# Altium project Carrier_Board.PrjPcb
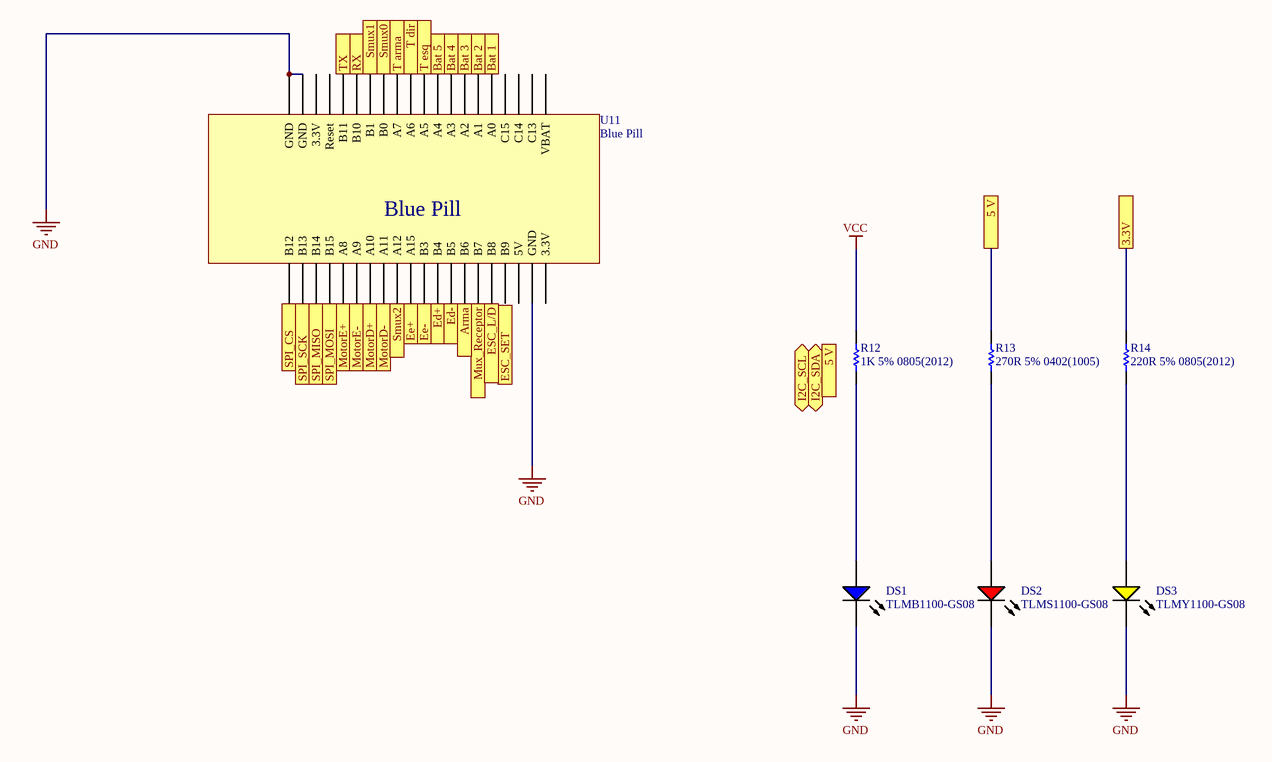
[diagram p0: Carrier_Board.SchDoc]
5 sheets, 41 parts. Net scope: flat (ports and power ports of the same name join across sheets).
Board file: Carrier_Board.PcbDoc
Sheets:
  Carrier_Board.SchDoc
  Recepitor.SchDoc
  ESP8266.SchDoc
  INA219AID.SchDoc
  Morpheus_conector.SchDoc

## Sheet Carrier_Board.SchDoc
size A4

### Parts
(Parts that share a designator on the sheet are numbered #1, #2 ... from top to bottom, then left to right.)
DS1  TLMB1100-GS08  [VISH-TLMX1100-2_V]
DS2  TLMS1100-GS08  [VISH-TLMX1100_V]
DS3  TLMY1100-GS08  [VISH-TLMX1100-2_V]
R12#1  1K 5% 0805(2012)  [RESC0805(2012)_N]
R13#1  270R 5% 0402(1005)  [RESC0402(1005)_N]
R14#1  220R 5% 0805(2012)  [RESC0805(2012)_N]
U11  Blue Pill  [blue pill]

### Ports
3.3V, 5 V, Arma (out), Bat 1 (in), Bat 2 (in), Bat 3 (in), Bat 4 (in), Bat 5 (in), Ed+ (in), Ed- (in), Ee+ (in), Ee- (in), ESC_L/D (out), ESC_SET (out), I2C_SCL (bidir), I2C_SDA (bidir), MotorD+ (out), MotorD- (out), MotorE+ (out), MotorE- (out), Mux_Receptor (in), RX, Smux0 (out), Smux1 (out), Smux2 (out), SPI_CS, SPI_MISO, SPI_MOSI, SPI_SCK, T arma (in), T dir (in), T esq (in), TX

### Nets
GND: DS1.2(K) DS2.2(K) DS3.2(K) U11.?19(GND) U11.?20(GND) U11.?39(GND)
VCC: R12#1.2
NetC11_1: R14#1.2 ; port 3.3V
NetC18_2: R13#1.2 ; port 5 V
NetDS1_1: DS1.1(A) R12#1.1
NetDS2_1: DS2.1(A) R13#1.1
NetDS3_1: DS3.1(A) R14#1.1
NetJ1_6: U11.?25(A8) ; port MotorE+
NetJ1_7: U11.?26(A9) ; port MotorE-
NetJ2_6: U11.?27(A10) ; port MotorD+
NetJ2_7: U11.?28(A11) ; port MotorD-
NetU9_RX: U11.?16(B10) ; port RX
NetU9_TX: U11.?17(B11) ; port TX
NetU10_5: U11.?35(B7) ; port Mux_Receptor
NetU10_9: U11.?14(B0) ; port Smux0
NetU10_10: U11.?15(B1) ; port Smux1
NetU10_11: U11.?29(A12) ; port Smux2
NetU11_?6: U11.?6(A0) ; port Bat 1
NetU11_?7: U11.?7(A1) ; port Bat 2
NetU11_?8: U11.?8(A2) ; port Bat 3
NetU11_?9: U11.?9(A3) ; port Bat 4
NetU11_?10: U11.?10(A4) ; port Bat 5
NetU11_?11: U11.?11(A5) ; port T esq
NetU11_?12: U11.?12(A6) ; port T dir
NetU11_?13: U11.?13(A7) ; port T arma
NetU11_?21: U11.?21(B12) ; port SPI_CS
NetU11_?22: U11.?22(B13) ; port SPI_SCK
NetU11_?23: U11.?23(B14) ; port SPI_MISO
NetU11_?24: U11.?24(B15) ; port SPI_MOSI
NetU11_?30: U11.?30(A15) ; port Ee+
NetU11_?31: U11.?31(B3) ; port Ee-
NetU11_?32: U11.?32(B4) ; port Ed+
NetU11_?33: U11.?33(B5) ; port Ed-
NetU11_?34: U11.?34(B6) ; port Arma
NetU11_?36: U11.?36(B8) ; port ESC_L/D

Not connected (* = marked no-connect by the designer): U11 ?1(VBAT) ?2(3.3V) ?3(C13) ?4(C14) ?5(C15) ?18(Reset) ?37(B9) ?38(5V) ?40(3.3V)

### Library data of the parts
DS1 = CMP-1666-00028-1: Blue LED, 10 mA, 3.9 V, -40 to 100 degC, 2-Pin SMD (0603), RoHS, Tape and Reel                  TLMB1100-GS08; Tolerance: 10%; Voltage Rating: 100 V; Capacitance: 10 nF; Type (Capacitors): X7R; Case\Package: Radial; ComponentLink1Description: Manufacturer URL; REACH SVHC: No SVHC; Package Quantity: 500; PackageDescription: 2-Pin Surface Mount Device, Body 1.6 x 0.8 mm; Pins: 2; ComponentLink2URL: http://download.siliconexpert.com/pdfs/2016/8/7/12/43/26/667/vsh_/manual/379263299541529tlmb1100.pdf; RoHSCompliant: true; Lead Pitch: 2.54 mm; Height: 2.54 mm; DatasheetVersion: Rev. 2.7, 03/2016; Length: 5.33 mm; ComponentLink1URL: http://www.vishay.com/; Min Operating Temperature: -55 degC; PackageReference: 0603; Packaging: Bulk; ComponentLink2Description: Datasheet; Max Operating Temperature: 125 degC; Radiation Hardening: No; Width: 3.81 mm; Mount: Through Hole
DS2 = CMP-1666-00027-1: LED, RED, 2.1 V, -40 to 100 degC, 2-Pin SMD (0603), RoHS, Tape and Reel; Type (Capacitors): C0G; Resistance: 100000000000 Ohm; Capacitance: 12 pF; Voltage Rating: 50 V; Tolerance: 5%; Min Operating Temperature: -55degC; REACH SVHC: No SVHC; ComponentLink2Description: Datasheet; ComponentLink1URL: http://www.vishay.com/; Width: 0.8 mm; Package Quantity: 4000; PackageReference: TLMX1100; ComponentLink2URL: http://www.vishay.com/docs/83173/tlmb1100.pdf; Case/Package: 0603; Case Code (Metric): 1608; Packaging: Tape and Reel; Pins: 2; ComponentLink1Description: Manufacturer URL; Max Operating Temperature: 125degC; Height: 0.8 mm; Length: 1.6 mm; Mount: Surface Mount; PackageDescription: 2-Pin Surface Mount Device, Body 1.6 x 0.8 mm; DatasheetVersion: Rev. 2.7, 03/2016; Case Code (Imperial): 0603; Voltage Rating (DC): 50 V; RoHSCompliant: True; Radiation Hardening: No
DS3 = CMP-1666-00030-1: Yellow LED, 20 mA, 2.1 V, -40 to 100 degC, 2-Pin SMD (0603), RoHS, Tape and Reel             TLMY1100-GS08; ComponentLink2Description: Datasheet; ComponentLink2URL: http://download.siliconexpert.com/pdfs/2016/8/7/12/43/26/667/vsh_/manual/379263299541529tlmb1100.pdf; ComponentLink1Description: Manufacturer URL; PackageDescription: 2-Pin Surface Mount Device, Body 1.6 x 0.8 mm; DatasheetVersion: Rev. 2.7, 03/2016; ComponentLink1URL: http://www.vishay.com/; PackageReference: 0603
R12#1 = CMP-1013-00074-1: 1K 0.125W 5% 0805 (2012 Metric)  SMD                                667-ERJ-P06J102V; Case-EIA: 0805; Case-Metric: 2012; Power: 0.500 W; Value: 1000.00 Ohm; Technology: SMT; Tolerance: 5 %
R13#1 = CMP-1011-00060-1: 270R 0.063W 5% 0402 (1005 Metric)  SMD                             603-AC0402JR-07270RL; Case-Metric: 1005; Value: 270.00 Ohm; Case-EIA: 0402; Tolerance: 5 %; Technology: SMT; Power: 0.063 W
R14#1 = CMP-1013-00058-1: 220R 0.125W 5% 0805 (2012 Metric)  SMD                               603-RC0805JR-7W220RL; Power: 0.250 W; Value: 220.00 Ohm; Case-Metric: 2012; Case-EIA: 0805; Technology: SMT; Tolerance: 5 %

## Sheet Recepitor.SchDoc
size A4
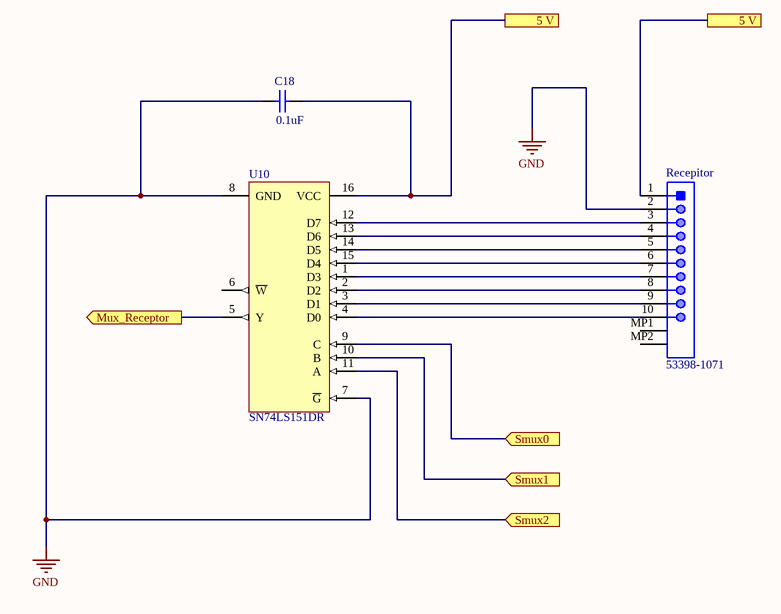
[diagram p1: Recepitor.SchDoc]

### Parts
C18  Capacitance Value: 0.1uF  [CAPC1608X90X30LL10T20]  (hidden comment: 710-885012206071)
Recepitor  53398-1071  [MOLX-53398-1071_V]
U10  SN74LS151DR  [D0016A_L]

### Ports
5 V, Mux_Receptor (out), Smux0 (in), Smux1 (in), Smux2 (in)

### Nets
GND: C18.1 Recepitor.2 U10.7(~{G}) U10.8(GND)
NetC18_2: C18.2 Recepitor.1 U10.16(VCC) ; port 5 V
NetRecepitor_3: Recepitor.3 U10.12(D7)
NetRecepitor_4: Recepitor.4 U10.13(D6)
NetRecepitor_5: Recepitor.5 U10.14(D5)
NetRecepitor_6: Recepitor.6 U10.15(D4)
NetRecepitor_7: Recepitor.7 U10.1(D3)
NetRecepitor_8: Recepitor.8 U10.2(D2)
NetRecepitor_9: Recepitor.9 U10.3(D1)
NetRecepitor_10: Recepitor.10 U10.4(D0)
NetU10_5: U10.5(Y) ; port Mux_Receptor
NetU10_9: U10.9(C) ; port Smux0
NetU10_10: U10.10(B) ; port Smux1
NetU10_11: U10.11(A) ; port Smux2

Not connected (* = marked no-connect by the designer): Recepitor MP1 MP2; U10 6(~{W})

### Library data of the parts
C18 = CMP-2000-06092-1: Chip Capacitor, 100 nF, +/- 10%, 50 V, -55 to 125 degC, 0603 (1608 Metric), RoHS, Tape and Reel               710-885012206071; Manufacturer: SamsungElectro-Mechanics; Product Length: 1.6mm; Voltage: 25Vdc; Product Height: 0.8mm; Rad Hard: No; Dielectric: X7R; Packaging: Tape&Reel; Package Description: 2-Pin Surface Mount Device, Body 1.60 x 0.80 mm; Package Reference: 0603; Datasheet Version: 06/2016; Operating Temperature: -55to125°C; Category: CapacitorCeramicMultilayer; Product Depth: 0.8mm; Mounting Technology: SurfaceMount; Package/Case: 0603; Tolerance: 10%; Construction: Flat; Mounting: SurfaceMount; Datasheet URL: https://br.mouser.com/datasheet/2/445/885012206071-554587.pdf
Recepitor = CMP-2000-05635-1: Male Header, Pitch 1.25 mm, 1 x 10 Position, Height 4.7 mm, -40 to 85 degC, RoHS, Tape and Reel; Manufacturer: Molex; Mounting Angle: Vertical; Pitch: 1.25mm; Voltage Rating: 125V; Current Rating: 1A; Number of Rows: 1Row; Housing Material: Nylon; Mounting Technology: SurfaceMount; Mounting Style: SMD; Contact Material: PhosphorBronze; Product: Headers; Datasheet URL: http://www.molex.com/pdm_docs/sd/533981071_sd.pdf; Manufacturer URL: http://www.molex.com/; Datasheet Version: Rev. J, 09/2015; Factory Pack Quantity: 1000; Brand: Molex; Packaging: Reel; Product Category: Headers&WireHousings; Contact Gender: Pin(Male); Number of Positions: 10Position; RoHS: Details; Contact Plating: Tin; Package Description: Male Header, Pitch 1.25 mm, 1 x 10 Position, Height 4.7 mm; Series: 53398; Type: Shrouded; Package Reference: 53398-1071; Tradename: PicoBlade; Termination Style: SMD
U10 = CMP-1633-00148-1: 8-Line To 1-Line Data Selectors/Multiplexers, D0016A, LARGE T&R; Manufacturer: Texas Instruments; VCC(Max)(V): 5.25; Configuration: "16","1"; Channels(#): 1; F @ Nom Voltage(Max)(Mhz): 35; Input Type: TTL; Output Drive (IOL/IOH)(Max)(mA): 8/-0.4; Voltage(Nom)(V): 5; Bits(#): 16; VCC(Min)(V): 4.75; Technology Family: LS; tpd @ Nom Voltage(Max)(ns): 38; Function: Encoder/Multiplexer; Schmitt Trigger: No; Rating: Catalog; ICC @ Nom Voltage(Max)(mA): 10; PartNumber: SN74LS151DR; Operating Temperature Range(C): 0 to 70; Type: Standard; ComponentLink3URL: http://www.ti.com/lit/ml/mpds178g/mpds178g.pdf; ComponentLink1Description: Manufacturer URL; ComponentLink2Description: Datasheet; DatasheetVersion: SDLS054; Output Type: TTL; PackageReference: D0016A; ComponentLink1URL: http://www.ti.com/; Code_JEDEC: MS-012 variation AC; ComponentLink2URL: http://www.ti.com/lit/ds/symlink/sn74ls151.pdf; ComponentLink3Description: Package Specification; Generic Part Number: SN74LS151

## Sheet ESP8266.SchDoc
size A4
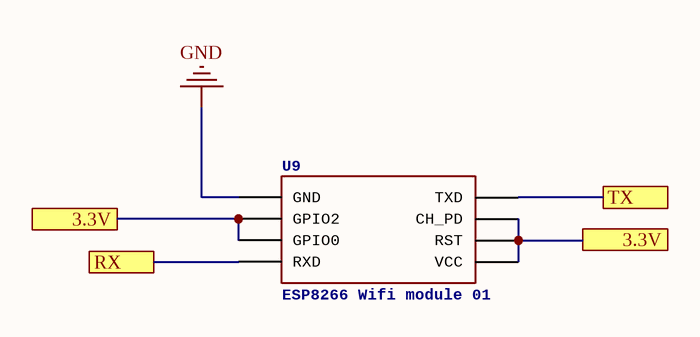
[diagram p2: ESP8266.SchDoc]

### Parts
U9  ESP8266 Wifi module 01  [ESP01]

### Ports
3.3V, RX, TX

### Nets
GND: U9.GND
NetC11_1: U9.CH_PD U9.GPIO0 U9.GPIO2 U9.RST U9.VCC ; port 3.3V
NetU9_RX: U9.RX(RXD) ; port RX
NetU9_TX: U9.TX(TXD) ; port TX

### Library data of the parts
U9 = ESP01: GateName_1: G$1; SymbolName_1: ESP01; LibraryName: esp8266modules; DeviceSetName: ESP01; Package: ESP01

## Sheet INA219AID.SchDoc
size A4
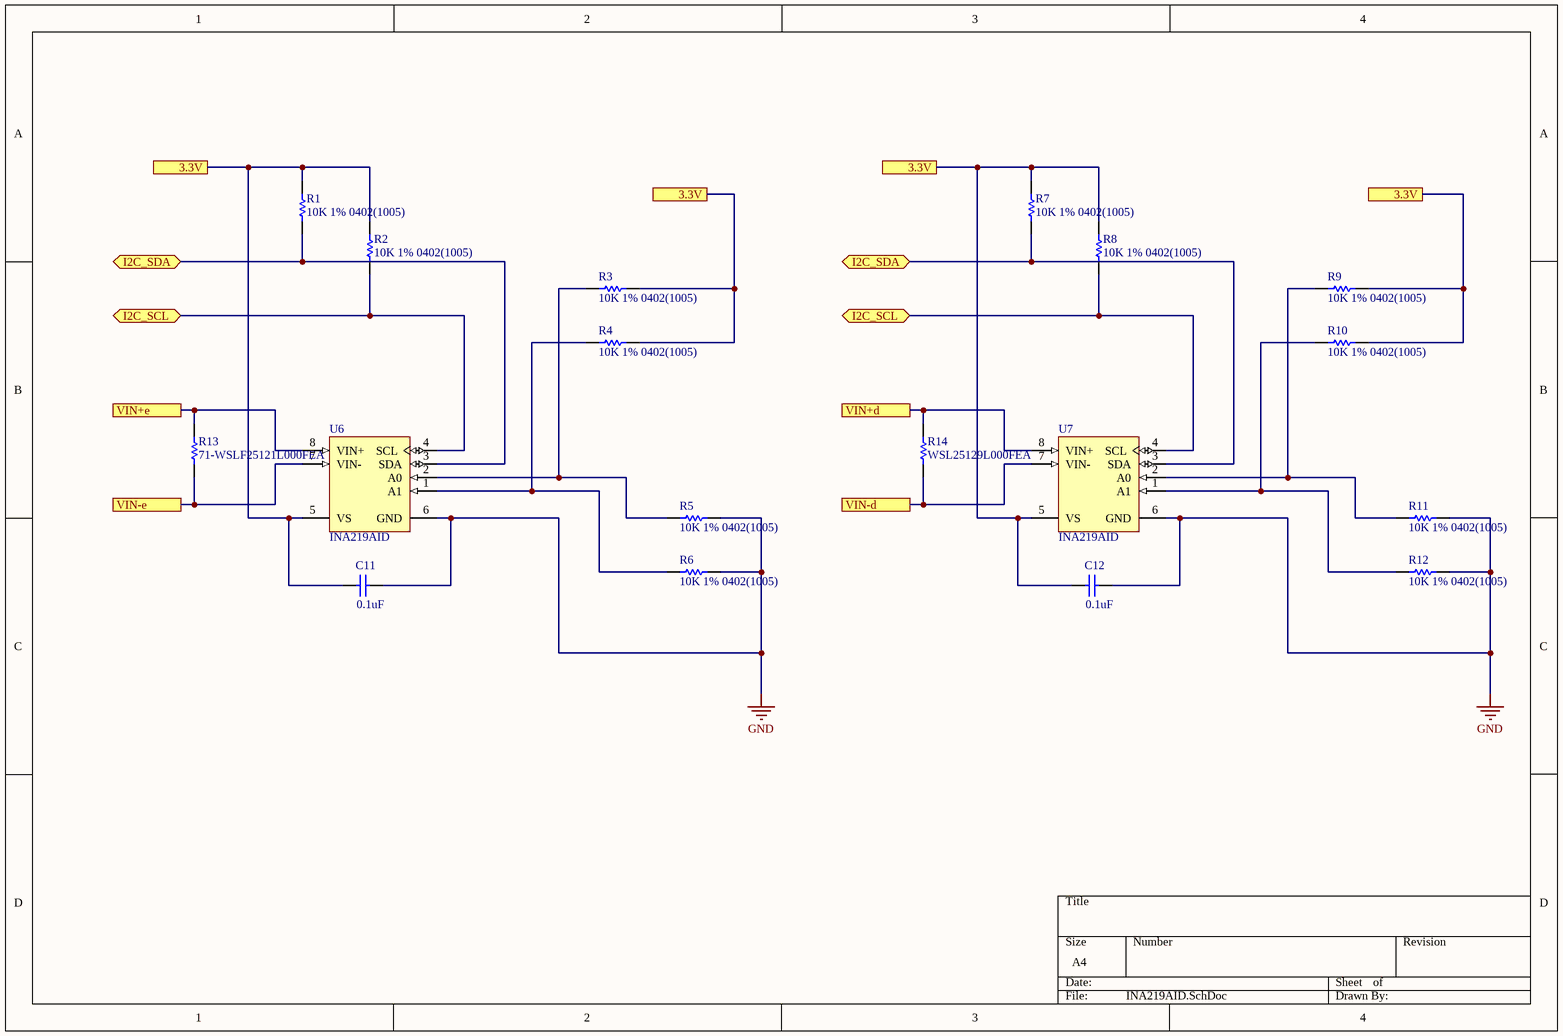
[diagram p3: INA219AID.SchDoc]

### Parts
(Parts that share a designator on the sheet are numbered #1, #2 ... from top to bottom, then left to right.)
C11  Capacitance Value: 0.1uF  [CAPC1608X90X30LL10T20]  (hidden comment: 710-885012206071)
C12  Capacitance Value: 0.1uF  [CAPC1608X90X30LL10T20]  (hidden comment: 710-885012206071)
R1  10K 1% 0402(1005)  [RESC0402(1005)_L]
R2  10K 1% 0402(1005)  [RESC0402(1005)_L]
R3  10K 1% 0402(1005)  [RESC0402(1005)_L]
R4  10K 1% 0402(1005)  [RESC0402(1005)_L]
R5  10K 1% 0402(1005)  [RESC0402(1005)_L]
R6  10K 1% 0402(1005)  [RESC0402(1005)_L]
R7  10K 1% 0402(1005)  [RESC0402(1005)_L]
R8  10K 1% 0402(1005)  [RESC0402(1005)_L]
R9  10K 1% 0402(1005)  [RESC0402(1005)_L]
R10  10K 1% 0402(1005)  [RESC0402(1005)_L]
R11  10K 1% 0402(1005)  [RESC0402(1005)_L]
R12#2  10K 1% 0402(1005)  [RESC0402(1005)_L]
R13#2  71-WSLF25121L000FEA  [RESC6432X89X76ML25T25]
R14#2  WSL25129L000FEA  [RESC6432X89X76ML25T25]
U6  INA219AID  [D0008A_N]
U7  INA219AID  [D0008A_N]

### Ports
3.3V, I2C_SCL (bidir), I2C_SDA (bidir), VIN+d, VIN+e, VIN-d, VIN-e

### Nets
GND: C11.2 C12.2 R5.1 R6.1 R11.2 R12#2.2 U6.6(GND) U7.6(GND)
NetC11_1: C11.1 C12.1 R1.2 R2.2 R3.1 R4.1 R7.1 R8.1 R9.2 R10.2 U6.5(VS) U7.5(VS) ; port 3.3V
NetJ1_2: R1.1 R7.2 U6.3(SDA) U7.3(SDA) ; port I2C_SDA
NetJ1_3: R2.1 R8.2 U6.4(SCL) U7.4(SCL) ; port I2C_SCL
NetR3_2: R3.2 R5.2 U6.2(A0)
NetR4_2: R4.2 R6.2 U6.1(A1)
NetR9_1: R9.1 R11.1 U7.2(A0)
NetR10_1: R10.1 R12#2.1 U7.1(A1)
NetR13#2_1: R13#2.1 U6.7(VIN-) ; port VIN-e
NetR13#2_2: R13#2.2 U6.8(VIN+) ; port VIN+e
NetR14#2_1: R14#2.1 U7.7(VIN-) ; port VIN-d
NetR14#2_2: R14#2.2 U7.8(VIN+) ; port VIN+d

### Library data of the parts
C11 = CMP-2000-06092-1: Chip Capacitor, 100 nF, +/- 10%, 50 V, -55 to 125 degC, 0603 (1608 Metric), RoHS, Tape and Reel                710-885012206071; Manufacturer: SamsungElectro-Mechanics; Product Length: 1.6mm; Voltage: 25Vdc; Product Height: 0.8mm; Rad Hard: No; Dielectric: X7R; Packaging: Tape&Reel; Package Description: 2-Pin Surface Mount Device, Body 1.60 x 0.80 mm; Package Reference: 0603; Datasheet Version: 06/2016; Operating Temperature: -55to125°C; Category: CapacitorCeramicMultilayer; Product Depth: 0.8mm; Mounting Technology: SurfaceMount; Package/Case: 0603; Tolerance: 10%; Construction: Flat; Mounting: SurfaceMount; Datasheet URL: https://br.mouser.com/datasheet/2/445/885012206071-554587.pdf
C12 = CMP-2000-06092-1: as C18 on sheet Recepitor; Packaging: Tape&Reel; Package Description: 2-Pin Surface Mount Device, Body 1.60 x 0.80 mm; Package Reference: 0603; Datasheet Version: 06/2016; Operating Temperature: -55to125°C; Category: CapacitorCeramicMultilayer; Product Depth: 0.8mm; Mounting Technology: SurfaceMount; Package/Case: 0603; Tolerance: 10%; Construction: Flat; Mounting: SurfaceMount; Datasheet URL: https://br.mouser.com/datasheet/2/445/885012206071-554587.pdf
R1 = CMP-1011-00623-1: 10K 0.063W 1% 0402 (1005 Metric)  SMD                                   71-CRCW040210K0FKEDC; Case-Metric: 1005; Value: 10000.00 Ohm; Case-EIA: 0402; Tolerance: 1 %; Technology: SMT; Power: 0.063 W
R2 = CMP-1011-00623-1: 10K 0.063W 1% 0402 (1005 Metric)  SMD                             71-CRCW040210K0FKEDC; Case-Metric: 1005; Value: 10000.00 Ohm; Case-EIA: 0402; Tolerance: 1 %; Technology: SMT; Power: 0.063 W
R3 = CMP-1011-00623-1: 10K 0.063W 1% 0402 (1005 Metric)  SMD                              71-CRCW040210K0FKEDC; Case-Metric: 1005; Value: 10000.00 Ohm; Case-EIA: 0402; Tolerance: 1 %; Technology: SMT; Power: 0.063 W
R4 = CMP-1011-00623-1: 10K 0.063W 1% 0402 (1005 Metric)  SMD                               71-CRCW040210K0FKEDC; Case-Metric: 1005; Value: 10000.00 Ohm; Case-EIA: 0402; Tolerance: 1 %; Technology: SMT; Power: 0.063 W
R5 = CMP-1011-00623-1: 10K 0.063W 1% 0402 (1005 Metric)  SMD                                 71-CRCW040210K0FKEDC; Case-Metric: 1005; Value: 10000.00 Ohm; Case-EIA: 0402; Tolerance: 1 %; Technology: SMT; Power: 0.063 W
R6 R12#2 = CMP-1011-00623-1: 10K 0.063W 1% 0402 (1005 Metric)  SMD                                      71-CRCW040210K0FKEDC; Case-Metric: 1005; Value: 10000.00 Ohm; Case-EIA: 0402; Tolerance: 1 %; Technology: SMT; Power: 0.063 W
R7 = CMP-1011-00623-1: 10K 0.063W 1% 0402 (1005 Metric)  SMD                                     71-CRCW040210K0FKEDC; Case-Metric: 1005; Value: 10000.00 Ohm; Case-EIA: 0402; Tolerance: 1 %; Technology: SMT; Power: 0.063 W
R8 = CMP-1011-00623-1: 10K 0.063W 1% 0402 (1005 Metric)  SMD                                    71-CRCW040210K0FKEDC; Case-Metric: 1005; Value: 10000.00 Ohm; Case-EIA: 0402; Tolerance: 1 %; Technology: SMT; Power: 0.063 W
R9 = CMP-1011-00623-1: 10K 0.063W 1% 0402 (1005 Metric)  SMD                                       71-CRCW040210K0FKEDC; Case-Metric: 1005; Value: 10000.00 Ohm; Case-EIA: 0402; Tolerance: 1 %; Technology: SMT; Power: 0.063 W
R10 = CMP-1011-00623-1: 10K 0.063W 1% 0402 (1005 Metric)  SMD                                71-CRCW040210K0FKEDC; Case-Metric: 1005; Value: 10000.00 Ohm; Case-EIA: 0402; Tolerance: 1 %; Technology: SMT; Power: 0.063 W
R11 = CMP-1011-00623-1: 10K 0.063W 1% 0402 (1005 Metric)  SMD                                  71-CRCW040210K0FKEDC; Case-Metric: 1005; Value: 10000.00 Ohm; Case-EIA: 0402; Tolerance: 1 %; Technology: SMT; Power: 0.063 W
R13#2 = CMP-2000-07419-1: Chip Resistor, 9 mOhm, +/- 1%, 1 W, -65 to 170 degC, 2512 (6432 Metric), RoHS, Tape and Reel                        71-WSLF25121L000FEA; Manufacturer: Vishay; Case Height: 0.635mm; Resistance: 0.009Ohms; Case Width: 3.2mm; Case Length: 6.4mm; Brand: Vishay/Dale; Power Rating: 6W; Temperature Coefficient: 75PPM/C; Series: WSL; Package / Case: 2512(6432metric); Package Reference: 2512; Type: PowerMetalStripResistors,LowValue(downto0.0005Ohms),SurfaceMount; Termination Style: SMD/SMT; Case Code - mm: 6432; Case Code - in: 2512; Factory Pack Quantity: 2000; Operating Temperature Range: -65Cto+170C; Tolerance: 1%; Packaging: Reel; Datasheet URL: http://www.vishay.com/docs/30100/wsl.pdf; Package Description: 2-Pin Surface Mount Device, Body 6.35 x 3.18 mm; Manufacturer URL: http://www.vishay.com/; Datasheet Version: 07/2016; RoHS: Details; Product: MetalElementCurrentSensingResistors; Mounting Technology: SurfaceMount; Product Category: CurrentSenseResistors-SMD
R14#2 = CMP-2000-07419-1: Chip Resistor, 9 mOhm, +/- 1%, 1 W, -65 to 170 degC, 2512 (6432 Metric), RoHS, Tape and Reel                       71-WSLF25121L000FEA; Manufacturer: Vishay; Case Height: 0.635mm; Resistance: 0.009Ohms; Case Width: 3.2mm; Case Length: 6.4mm; Brand: Vishay/Dale; Power Rating: 6W; Temperature Coefficient: 75PPM/C; Series: WSL; Package / Case: 2512(6432metric); Package Reference: 2512; Type: PowerMetalStripResistors,LowValue(downto0.0005Ohms),SurfaceMount; Termination Style: SMD/SMT; Case Code - mm: 6432; Case Code - in: 2512; Factory Pack Quantity: 2000; Operating Temperature Range: -65Cto+170C; Tolerance: 1%; Packaging: Reel; Datasheet URL: http://www.vishay.com/docs/30100/wsl.pdf; Package Description: 2-Pin Surface Mount Device, Body 6.35 x 3.18 mm; Manufacturer URL: http://www.vishay.com/; Datasheet Version: 07/2016; RoHS: Details; Product: MetalElementCurrentSensingResistors; Mounting Technology: SurfaceMount; Product Category: CurrentSenseResistors-SMD
U6 U7 = CMP-0704-00006-2: Zero-Drift, Bi-Directional Current / Power Monitor, 3 to 5.5 V, -40 to 125 degC, 8-pin SOIC (D8), Green (RoHS & no Sb/Br); Manufacturer: Texas Instruments; Vs(Max)(V): 5.5; Rating: Catalog; Gain(V/V): 1, 0.5, 0.25, 0.125; Vs(Min)(V): 3; Common Mode Range(Max)(V): 26; Input Offset (+/-)(Max)(uV): 100; Small-Signal Bandwidth(Typ)(MHz): 0.011; SubFamily: Current Shunt Monitor; Common Mode Range(Min)(V): 0; Quiescent Current (+/-)(Typ)(mA): 0.7; PartNumber: INA219AID; ComponentLink2Description: Datasheet; PackageVersion: 4040047-3/M, 06/2011; ComponentLink3Description: Package Specification; Mounting Technology: Surface Mount; ComponentLink2URL: http://www.ti.com/general/docs/lit/getliterature.tsp?genericPartNumber=INA219&fileType=pdf; Eco-Plan: Green (RoHS & no Sb/Br); DatasheetVersion: SBOS448F; Code_JEDEC: MS-012; PackageDescription: 8-Pin Plastic Small Outline, Body 4.9 x 3.9 mm, Pitch 1.27 mm; ComponentLink1Description: Manufacturer URL; ComponentLink1URL: http://www.ti.com/; PackageReference: D0008A; ComponentLink3URL: http://www.ti.com/lit/ml/msoi002j/msoi002j.pdf; CMRR(Min)(dB): 100

## Sheet Morpheus_conector.SchDoc
size A4
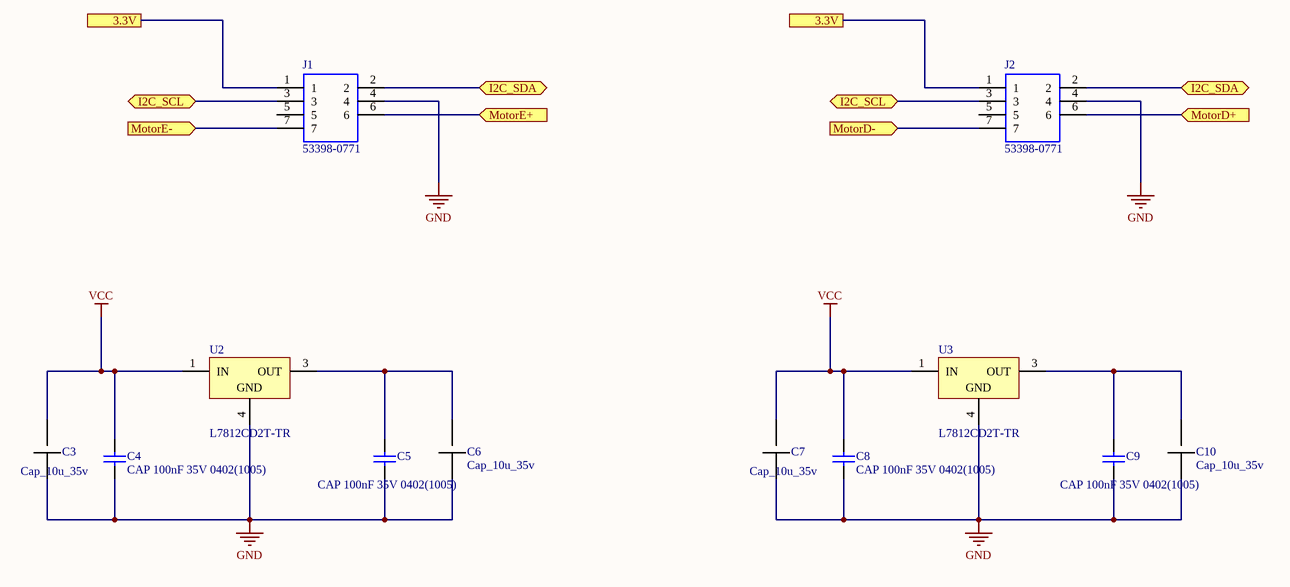
[diagram p4: Morpheus_conector.SchDoc]

### Parts
C3  Cap_10u_35v  [CAP POL 2917/7343]
C4  CAP 100nF 35V 0402(1005)  [CAPC0402(1005)60_N]
C5  CAP 100nF 35V 0402(1005)  [CAPC0402(1005)60_N]
C6  Cap_10u_35v  [CAP POL 2917/7343]
C7  Cap_10u_35v  [CAP POL 2917/7343]
C8  CAP 100nF 35V 0402(1005)  [CAPC0402(1005)60_N]
C9  CAP 100nF 35V 0402(1005)  [CAPC0402(1005)60_N]
C10  Cap_10u_35v  [CAP POL 2917/7343]
J1  53398-0771  [53398-0771]
J2  53398-0771  [53398-0771]
U2  L7812CD2T-TR  [TO-263_N]
U3  L7812CD2T-TR  [TO-263_N]

### Ports
3.3V, I2C_SCL (bidir), I2C_SDA (bidir), MotorD+ (in), MotorD- (in), MotorE+ (in), MotorE- (in)

### Nets
GND: C3.1 C4.1 C5.1 C6.1 C7.1 C8.1 C9.1 C10.1 J1.4 J2.4 U2.4(GND) U3.4(GND)
VCC: C3.2 C4.2 C7.2 C8.2 U2.1(IN) U3.1(IN)
NetC5_2: C5.2 C6.2 U2.3(OUT)
NetC9_2: C9.2 C10.2 U3.3(OUT)
NetC11_1: J1.1 J2.1 ; port 3.3V
NetJ1_2: J1.2 J2.2 ; port I2C_SDA
NetJ1_3: J1.3 J2.3 ; port I2C_SCL
NetJ1_6: J1.6 ; port MotorE+
NetJ1_7: J1.7 ; port MotorE-
NetJ2_6: J2.6 ; port MotorD+
NetJ2_7: J2.7 ; port MotorD-

Not connected (* = marked no-connect by the designer): J1 5; J2 5

### Library data of the parts
C3 C6 C7 C10 = Cap_10u_35v: 80-T491D106M35AT7280
C4 C5 C9 = CMP-1034-02076-1: CAP 100nF 35V ±20% 0402 (1005 Metric) Thickness 0.6mm SMD                                                 963-GMK105BJ104MV-F; Case-Metric: 1005; Tolerance: Â±20%; Case-EIA: 0402; Rated Voltage: 35 V; Max Thickness: 0.6 mm; Value: 100nF; Technology: SMT
C8 = CMP-1034-02076-1: CAP 100nF 35V ±20% 0402 (1005 Metric) Thickness 0.6mm SMD                                        963-GMK105BJ104MV-F; Case-Metric: 1005; Tolerance: Â±20%; Case-EIA: 0402; Rated Voltage: 35 V; Max Thickness: 0.6 mm; Value: 100nF; Technology: SMT
J1 J2 = 53398-0771: 7 way SMT straight header Molex PICOBLADE Series, Series Number 53398, 1.25mm Pitch 7 Way 1 Row Straight PCB Header, Solder Termination, 1A; Allied_Number: 70373150; Manufacturer_Name: Molex; Manufacturer_Part_Number: 53398-0771; RS Part Number: 5427220P; RS Price/Stock: http://uk.rs-online.com/web/p/products/5427220P; Allied Price/Stock: http://www.alliedelec.com/molex-incorporated-53398-0771/70373150/; Arrow Part Number: 53398-0771; Arrow Price/Stock: http://uk.rs-online.com/web/p/products/5427220P; Datasheet Link: http://www.molex.com/webdocs/datasheets/pdf/en-us/0533980771_PCB_HEADERS.pdf
U2 U3 = CMP-0244-00182-1: Positive Voltage Regulator, 3-Pin D2PAK, Tape and Reel; PackageDescription: 3-Pin Transistor Outline Package 2.54 mm Pitch, 15.4 mm Lead Span (D2PAK); ComponentLink1Description: Manufacturer URL; PackageReference: TO-263; DatasheetVersion: 16/11/2011; ComponentLink2URL: http://www.st.com/internet/com/TECHNICAL_RESOURCES/TECHNICAL_LITERATURE/DATASHEET/CD00000444.pdf; ComponentLink1URL: http://www.st.com; PackageVersion: 2011; ComponentLink2Description: Datasheet

## Nets that join several sheets
GND: Carrier_Board (6 pins), Recepitor (C18.1 Recepitor.2 U10.7 U10.8), ESP8266 (U9.GND), INA219AID (8 pins), Morpheus_conector (12 pins)
VCC: Carrier_Board (R12#1.2), Morpheus_conector (6 pins)
NetC11_1: Carrier_Board (R14#1.2), ESP8266 (5 pins), INA219AID (12 pins), Morpheus_conector (J1.1 J2.1)
NetC18_2: Carrier_Board (R13#1.2), Recepitor (C18.2 Recepitor.1 U10.16)
NetJ1_2: INA219AID (R1.1 R7.2 U6.3 U7.3), Morpheus_conector (J1.2 J2.2)
NetJ1_3: INA219AID (R2.1 R8.2 U6.4 U7.4), Morpheus_conector (J1.3 J2.3)
NetJ1_6: Carrier_Board (U11.?25), Morpheus_conector (J1.6)
NetJ1_7: Carrier_Board (U11.?26), Morpheus_conector (J1.7)
NetJ2_6: Carrier_Board (U11.?27), Morpheus_conector (J2.6)
NetJ2_7: Carrier_Board (U11.?28), Morpheus_conector (J2.7)
NetU9_RX: Carrier_Board (U11.?16), ESP8266 (U9.RX)
NetU9_TX: Carrier_Board (U11.?17), ESP8266 (U9.TX)
NetU10_5: Carrier_Board (U11.?35), Recepitor (U10.5)
NetU10_9: Carrier_Board (U11.?14), Recepitor (U10.9)
NetU10_10: Carrier_Board (U11.?15), Recepitor (U10.10)
NetU10_11: Carrier_Board (U11.?29), Recepitor (U10.11)